# EAGLE design PX4AIRSPEEDv1.1 (EAGLE 6.4)
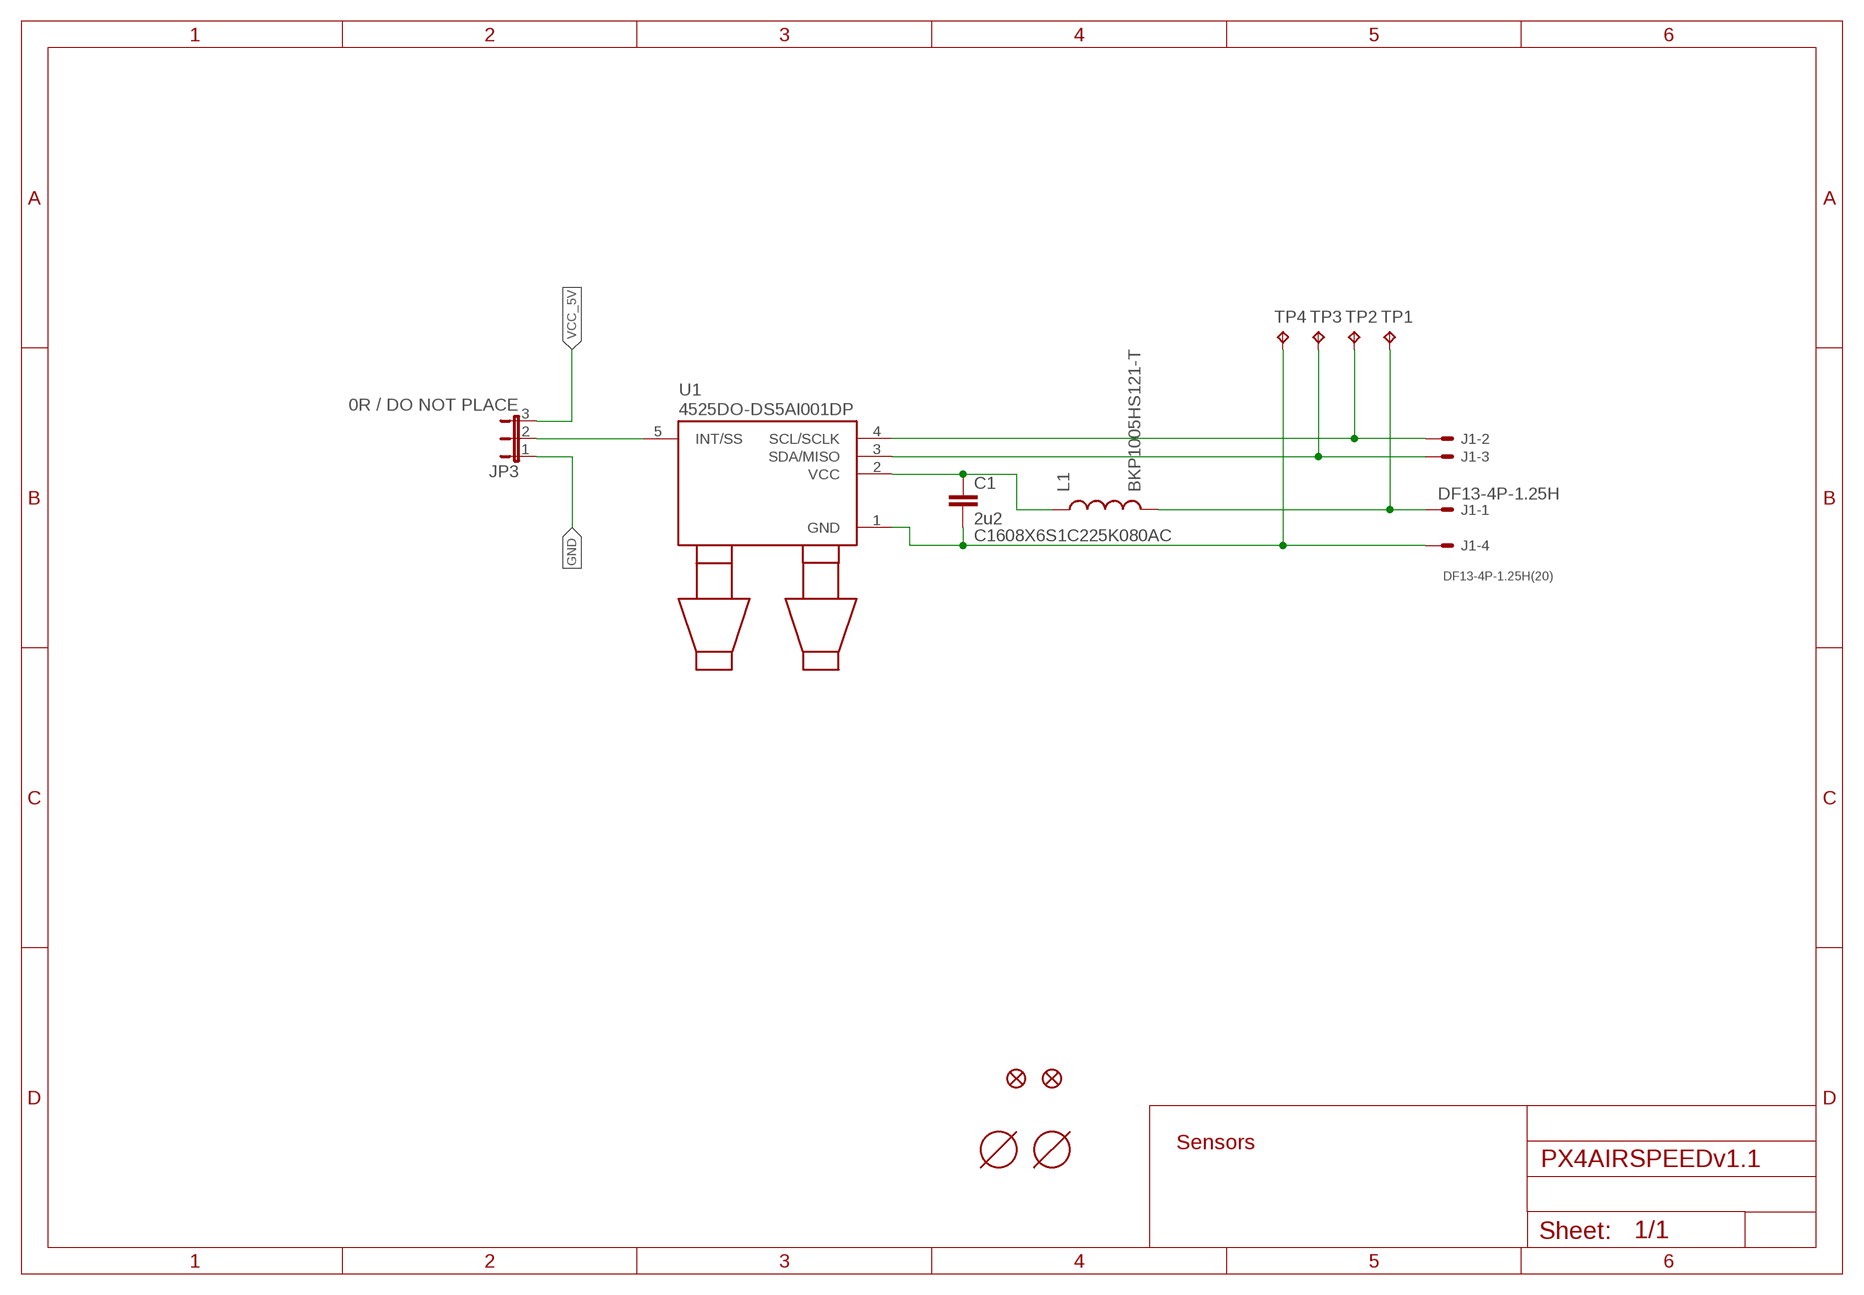
[diagram p0: schematic, sheet 1]

## Parts
C1  2u2  CAP0603  [0603-CAP]
J1  DF13-4P-1.25H  [DF13A-4P-1.25H]
JP1  FIDUCIAL1X2  [FIDUCIAL-1X2]
JP2  FIDUCIAL1X2  [FIDUCIAL-1X2]
JP3  0R / DO NOT PLACE  JUMPER-30603  [SJ_3_0603_PASTE1&2]
L1  BKP1005HS121-T  INDUCTOR0402  [0402-IND]
TP1  TPTP15R  [TP15R]
TP2  TPTP15R  [TP15R]
TP3  TPTP15R  [TP15R]
TP4  TPTP15R  [TP15R]
U1  4525DO-DS5AI001DP  [4525DO-DS5AI001DP]
U$2  MOUNT-HOLE3.1MM  [MOUNT-HOLE3.1]
U$4  MOUNT-HOLE3.1MM  [MOUNT-HOLE3.1]

## Nets
GND [power]: C1.P$2 J1.4 JP3.1 TP4.TP U1.1(GND)
N$3: J1.2 TP2.TP U1.4(SCL/SCLK)
N$4: J1.3 TP3.TP U1.3(SDA/MISO)
N$5: J1.1 L1.P$2 TP1.TP
N$7: JP3.2 U1.5(INT/SS)
VCC_5V: C1.P$1 JP3.3 L1.P$1 U1.2(VCC)

## Notes on the sheet
- Sensors

## Library data of the parts
C1 = pixhawk2:CAP: Capacitor Standard 0603 ceramic capacitor, and 0.1" leaded capacitor.; PARTNO: C1608X6S1C225K080AC
J1 = pixhawk2:DF13-4P-1.25?; PARTNO: DF13-4P-1.25H(20)
JP1 JP2 = pixhawk2:FIDUCIAL: Fiducial Alignment Points Various fiducial points for machine vision alignment.; BOM: EXCLUDE; PARTNO: *
JP3 = pixhawk2:JUMPER-3; BOM: EXCLUDE; PARTNO: *
L1 = pixhawk2:INDUCTOR: Inductors Basic Inductor/Choke - 0603 and 1210. Footprints are not proven and vary greatly between part numbers. SRR1210: Bourns SRR1210 parts, e.g. SRR1210-100M; PARTNO: BKP1005HS121-T
TP1-TP4 = testpad:TP: Test pad; BOM: EXCLUDE; PARTNO: *
U1 = pixhawk2:4525DO-DS5AI001DP; PARTNO: 4525DO-DS5AI001DP
U$2 U$4 = pixhawk2:MOUNT-HOLE; BOM: EXCLUDE; PARTNO: *

## Net classes
0 signal: width 0.152 mm, drill 0.2 mm, clearance 0.152 mm
1 power: width 0.254 mm, drill 0.3 mm, clearance 0.152 mm

## Board
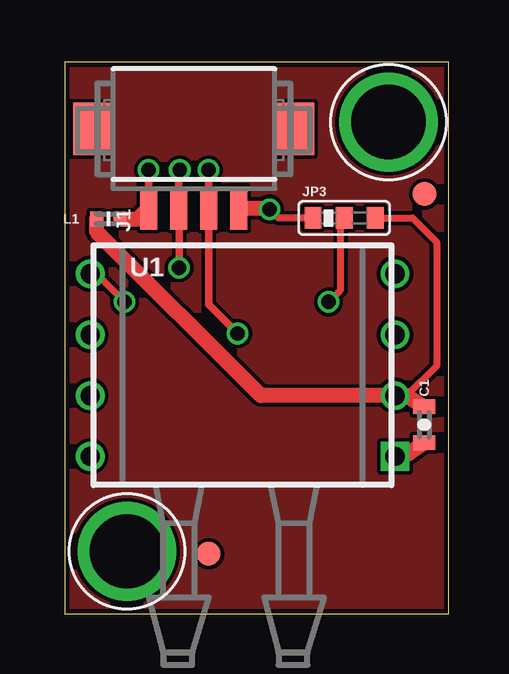
[diagram p1: board, top side]
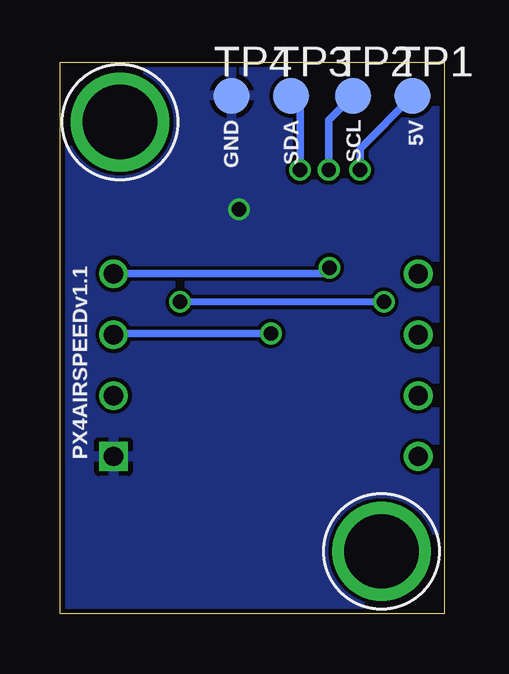
[diagram p2: board, bottom side, seen from below]

Size 16 x 23 mm. Coordinates in mm from the lower left corner, seen from the top.
Outline: 0,0 16,0 16,23 0,23 0,0
Copper layers (1*2*15*16): Top 0.035mm / dielectric 0.5mm / Route2 0.035mm / dielectric 0.5mm / Route15 0.035mm / dielectric 0.5mm / Bottom 0.035mm
Design rules "pixhawk2": minimum track width 0.15mm, minimum drill 0.3mm, track to track 0.15mm, track to pad 0.15mm, pad to pad 0.15mm, via to via 0.15mm, smd to smd 0.15mm, copper to edge 0.2mm, drill to drill 0.2mm, minimum pad ring 0.125mm, minimum via ring 0.125mm, stop-mask expansion 1mil, vias tented up to drill 0.31mm, thermal gap 8mil

### Footprints (pad centres in the part's own frame; a part is rotated, then mirrored left to right if it is on the bottom)
0603-CAP = smd 0.6 x 0.9: P$1 -0.75,0; P$2 0.75,0
DF13A-4P-1.25H = smd 0.7 x 1.8: 1 -1.875,-3.3; 2 -0.625,-3.3; 3 0.625,-3.3; 4 1.875,-3.3 | smd 1.6 x 2.2: S1 4.225,0; S2 -4.225,0
FIDUCIAL-1X2 = smd 1 x 1: 1 0,0
SJ_3_0603_PASTE1&2 = smd 0.7 x 0.9: 1 -0.65,0; 2 0.65,0; 3 1.95,0
0402-IND = smd 0.5 x 0.6: P$1 -0.5,0; P$2 0.5,0
TP15R = smd 1.5 x 1.5: TP 0,0
4525DO-DS5AI001DP = drill 0.8 square: 1 6.35,-3.81 | drill 0.8: 2 6.35,-1.27; 3 6.35,1.27; 4 6.35,3.81; 5 -6.35,3.81; 6 -6.35,1.27; 7 -6.35,-1.27; 8 -6.35,-3.81
MOUNT-HOLE3.1 = drill 3.1 pad 4.1: P$1 0,0

### Placement (x,y rotation side)
C1  14.99,7.87 270 top
J1  5.38,20.22 0 top
JP1  15,17.5 0 top
JP2  6,2.5 0 top
JP3  11,16.5 0 top
L1  1.83,16.46 0 top
TP1  1.31,21.59 0 bottom
TP2  3.79,21.59 0 bottom
TP3  6.37,21.59 0 bottom
TP4  8.85,21.59 0 bottom
U1  7.42,10.36 0 top
U$2  2.6,2.6 0 top
U$4  13.5,20.5 0 top

### Tracks (layer width: path | path; a pad name or v marks a point on that pad's centre or on a via)
GND  (via drill 0.6)
  Top 0.3: JP3.1 8.9,16.5 v8.53,16.87
  Top 0.635: U1.1 14.16,6.55 C1.P$2 | J1.4 8.48,16.92 v8.53,16.87
  pour Bottom: 0,0 16.02,0 16.02,23.02 0,23.02
N$3  (via drill 0.6)
  Top 0.305: v4.78,14.43 4.78,16.9 J1.2 4.76,18.46 v4.8,18.5
  Bottom 0.305: U1.4 5.03,14.17 v4.78,14.43 | v4.8,18.5 4.8,20.58 TP2.TP
N$4  (via drill 0.6)
  Top 0.305: v7.21,11.68 6.01,12.89 J1.3 v6.01,18.49 v6,18.5
  Bottom 0.305: v7.21,11.68 13.72,11.68 U1.3 | v6,18.5 6,21.22 TP3.TP
N$5  (via drill 0.6)
  Top 0.305: J1.1 v3.5,18.5
  Top 0.406: 3.51,16.46 J1.1
  Top 0.635: L1.P$2 3.05,16.46 J1.1
  Bottom 0.305: v3.5,18.5 3.5,19.4 TP1.TP
N$7  (via drill 0.6)
  Top 0.3: U1.5 1.33,14.17 v2.5,13 | v11,13 11.5,13.5 11.5,16.35 JP3.2
  Bottom 0.3: v2.5,13 v11,13
VCC_5V
  Top 0.3: JP3.3 14.5,16.5 15.5,15.5 15.5,10.33 14.27,9.09
  Top 0.635: L1.P$1 1.33,15.94 8.18,9.09 U1.2 14.27,9.09 C1.P$1
VDD_3V3_SENSORS
  pour Top: 0,0 0,23.02 16.02,23.02 16.02,0

### Text on the board
bPlace: 5V | SCL | SDA | GND | PX4AIRSPEEDv1.1